# Altium schematic sheet Sheet2.SchDoc
size A4; SheetNumber: 2; SheetTotal: 2
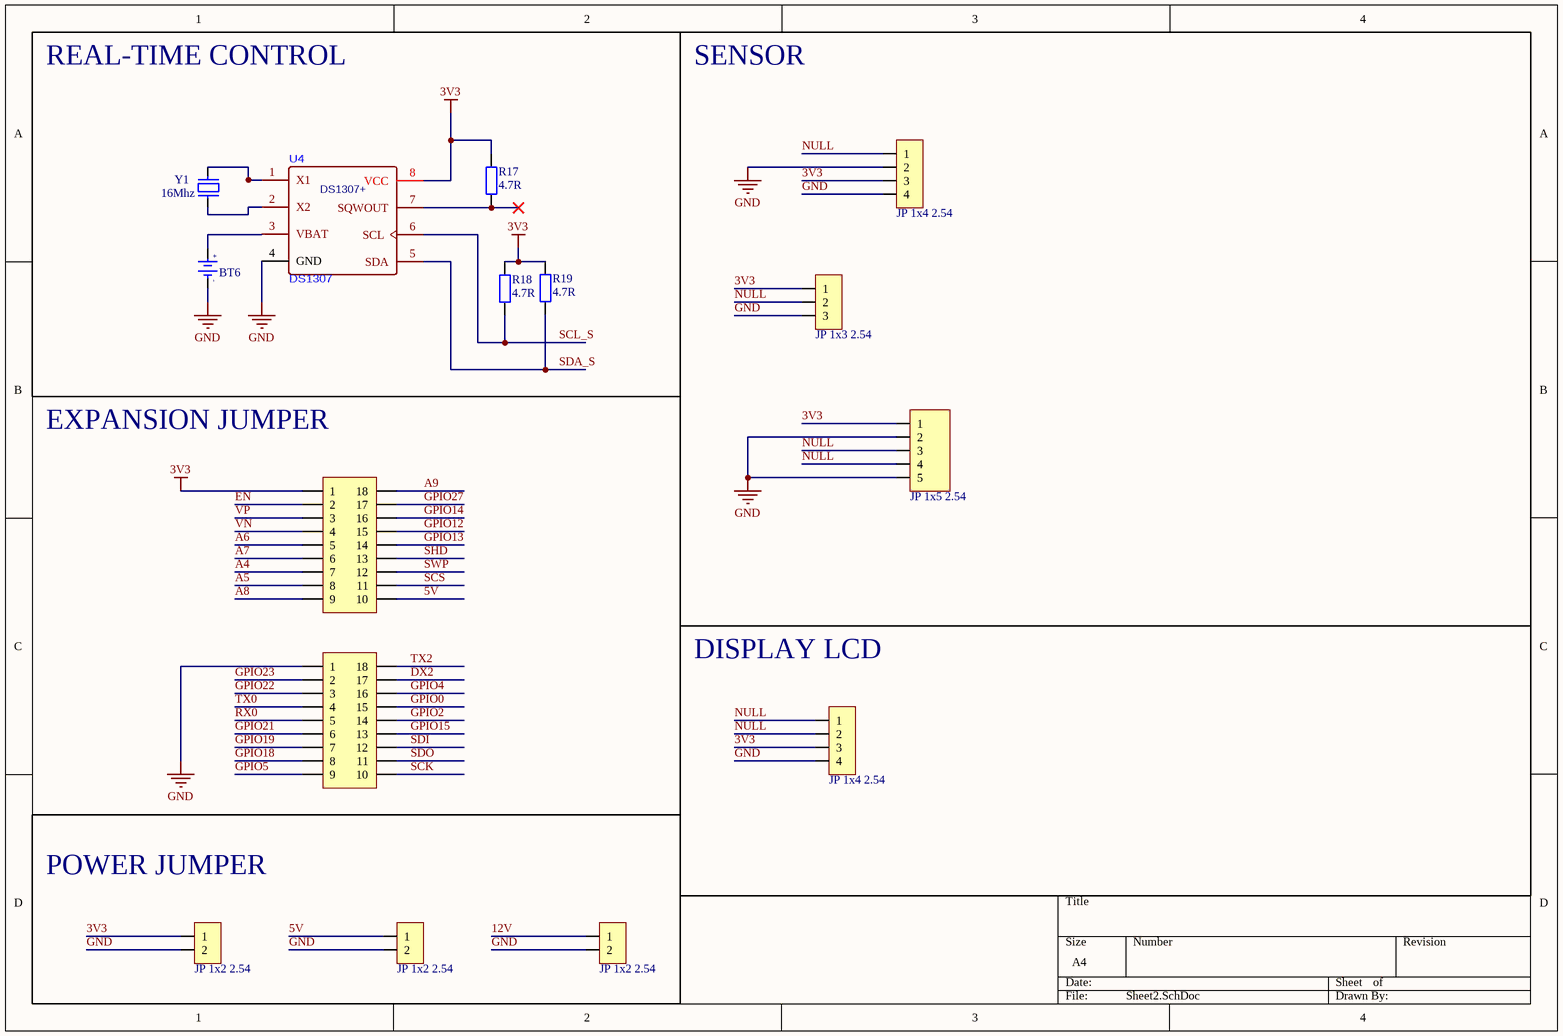
[diagram p0: Sheet2.SchDoc]

## Parts
BT6  NI-MH 3.6V 20mAh 3/V20H  [PIN 3.6V 20mAh 3/V20H]  (value not drawn)
JP1  JP 2x9 2.54  [JP 2x9 DT]  (value not drawn)
JP2  JP 2x9 2.54  [JP 2x9 DT]  (value not drawn)
JP3  JP 1x3 2.54  [JP 1x3 DT]
JP4  JP 1x4 2.54  [JP 1x4 DT]
JP5  JP 1x5 2.54  [JP 1x5 DT]
JP6  JP 1x4 2.54  [JP 1x4 DT]
JP7  JP 1x2 2.54  [JP 1x2 DT]
JP8  JP 1x2 2.54  [JP 1x2 DT]
JP9  JP 1x2 2.54  [JP 1x2 DT]
R17  4.7R  [tro vach 2w]
R18  4.7R  [tro vach 2w]
R19  4.7R  [tro vach 2w]
U4  DS1307  [SOP 8]
Y1  16Mhz  [Thach Anh 2 Chan 32,768 KHz]

## Blocks framed on the sheet
REAL-TIME CONTROL: BT6 R17-R19 U4 Y1
SENSOR: JP3 JP5 JP6
DISPLAY LCD: JP4
POWER JUMPER: JP7-JP9

## Nets
3V3: JP1.1 JP3.1 JP4.3 JP5.1 JP6.3 JP7.1 R17.2 R18.2 U4.8(VCC)
GND: BT6.2(GND) JP2.1 JP3.3 JP4.4 JP5.2 JP5.5 JP6.2 JP6.4 JP7.2 JP8.2 JP9.2 U4.4(GND)
5V: JP1.10 JP8.1
12V: JP9.1
A4: JP1.7
A5: JP1.8
A6: JP1.5
A7: JP1.6
A8: JP1.9
A9: JP1.18
DX2: JP2.17
EN: JP1.2
GPIO0: JP2.15
GPIO2: JP2.14
GPIO4: JP2.16
GPIO5: JP2.9
GPIO12: JP1.15
GPIO13: JP1.14
GPIO14: JP1.16
GPIO15: JP2.13
GPIO18: JP2.8
GPIO19: JP2.7
GPIO21: JP2.6
GPIO22: JP2.3
GPIO23: JP2.2
GPIO27: JP1.17
NULL: JP3.2 JP4.1 JP4.2 JP5.3 JP5.4 JP6.1
RX0: JP2.5
SCK: JP2.10
SCL_S: R18.1 U4.6(SCL)
SCS: JP1.11
SDA_S: R19.2 U4.5(SDA)
SDI: JP2.12
SDO: JP2.11
SHD: JP1.13
SWP: JP1.12
TX0: JP2.4
TX2: JP2.18
VN: JP1.4
VP: JP1.3
NetBT6_1: BT6.1(+3V) U4.3(VBAT)
NetR17_1: R17.1 U4.7(SQWOUT)
NetU4_1: U4.1(X1) Y1.2
NetU4_2: U4.2(X2) Y1.1

Not connected (* = marked no-connect by the designer): R19 1

## Notes on the sheet
- EXPANSION JUMPER
- (in symbol DS1307) DS1307+
- (in symbol PIN 3V) +; -

## Library data of the parts
BT6 = PIN 3V: Battery 3VDC , NI-MH 3.6V 20mAh 3/V20H; Value: PIN 3V
JP1 JP2 = JP 2x9 2.54 Duc Thang: Cắm; Ten_Linh_Kien: Jump Đôi Đực 2.54MM 2x40P Thẳng 11MM; Don_Vi: Con; Ma_Hang: MH002686; Ghi_Chu: *; Kieu_Chan: *; Chung_Loai: Cắm
JP3 = JP 1x3 2.54 Duc Thang: Cắm; Ten_Linh_Kien: Jump Đơn Đực 2.54MM 1x40P Thẳng 11MM; Don_Vi: Con; Ma_Hang: MH000903; Ghi_Chu: *; Kieu_Chan: *; Chung_Loai: Cắm
JP4 JP6 = JP 1x4 2.54 Duc Thang: Cắm; Ten_Linh_Kien: Jump Đơn Đực 2.54MM 1x40P Thẳng 11MM; Don_Vi: Con; Ma_Hang: MH000903; Ghi_Chu: *; Kieu_Chan: *; Chung_Loai: Cắm
JP5 = JP 1x5 2.54 Duc Thang: Cắm; Ten_Linh_Kien: Jump Đơn Đực 2.54MM 1x40P Thẳng 11MM; Don_Vi: Con; Ma_Hang: MH000903; Ghi_Chu: *; Kieu_Chan: *; Chung_Loai: Cắm
JP7-JP9 = JP 1x2 2.54 Duc Thang: Cắm; Ten_Linh_Kien: Jump Đơn Đực 2.54MM 1x40P Thẳng 11MM; Don_Vi: Con; Ma_Hang: MH000903; Ghi_Chu: *; Kieu_Chan: *; Chung_Loai: Cắm
R17-R19 = Tro Vach 2W 5% 4.7R: Cắm; Don_Vi: Con; So_Chan: 2; Ten_Linh_Kien: Trở 5% 2w 4.7R; Ma_Hang: MH006375; Chung_Loai: Cắm; Kieu_Chan: *
U4 = DS1307: C5145427
Y1 = Thach Anh 2 chan 32,768 Khz: Crystal For all Crystal 2pin.; Value: 4Mhz